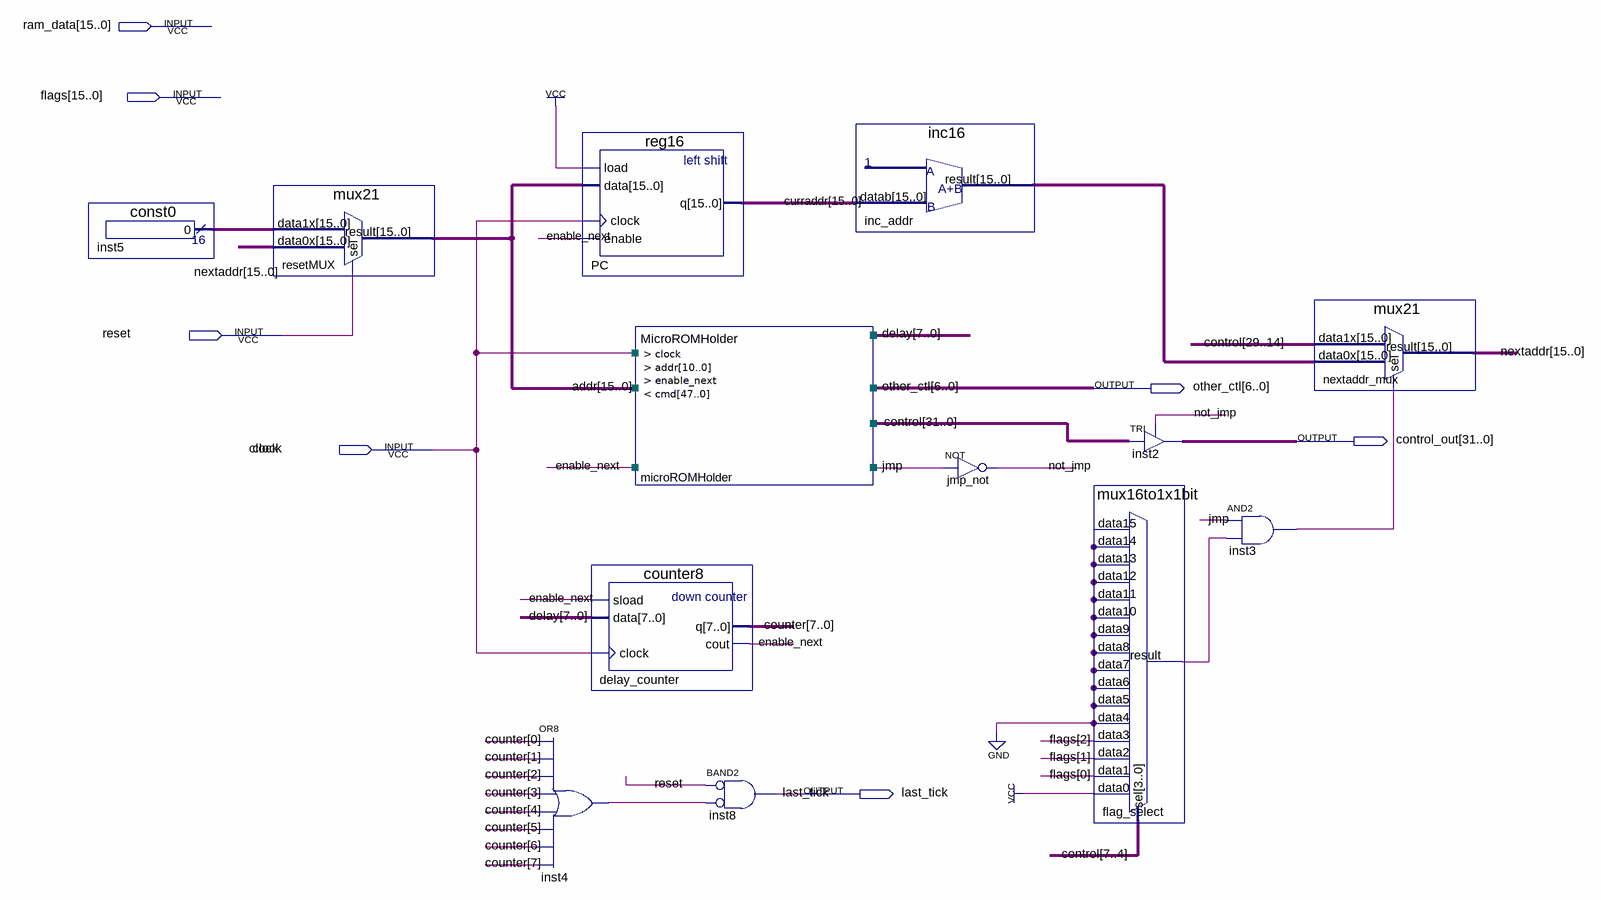
[diagram p0: schematic sheet]
// Quartus schematic BMC.bdf as structural Verilog: 13 symbols, 7 pins
module BMC (
  input  [15:0] ram_data,
  input  [15:0] flags,
  input  reset,
  input  clock,
  output [6:0] other_ctl,
  output [31:0] control_out,
  output last_tick
);

  wire enable_next, flag_select_result, inst3_out, inst4_out, jmp, not_jmp;
  wire [7:0] counter, delay;
  wire [15:0] addr, curraddr, inc_addr_result, inst5_result, nextaddr;
  wire [31:0] control;

  const0 inst5 (.result(inst5_result));
  mux21 resetMUX (.data1x(inst5_result), .data0x(nextaddr), .sel(reset), .result(addr));
  or inst4 (inst4_out, counter[0], counter[1], counter[2], counter[3], counter[4], counter[5], counter[6], counter[7]);
  reg16 PC (.load(1'b1), .data(addr), .clock(clock), .enable(enable_next), .q(curraddr));
  MicroROMHolder microROMHolder (.clock(clock), .addr(addr[10:0]), .enable_next(enable_next));  // open: cmd
  counter8 delay_counter (.sload(enable_next), .data(delay), .clock(clock), .cout(enable_next), .q(counter));
  and inst8 (last_tick, ~reset, ~inst4_out);  // BAND2
  inc16 inc_addr (.datab(curraddr), .result(inc_addr_result));
  not jmp_not (not_jmp, jmp);
  TRI inst2[31:0] (.IN(control), .OE(not_jmp), .OUT(control_out));
  mux16to1x1bit flag_select (
    .data15(1'b0), .data14(1'b0), .data13(1'b0), .data12(1'b0), .data11(1'b0), .data10(1'b0), .data9(1'b0),
    .data8(1'b0), .data7(1'b0), .data6(1'b0), .data5(1'b0), .data4(1'b0), .data3(flags[2]), .data2(flags[1]),
    .data1(flags[0]), .data0(1'b1), .sel(control[7:4]), .result(flag_select_result));
  and inst3 (inst3_out, jmp, flag_select_result);
  mux21 nextaddr_mux (.data1x(control[29:14]), .data0x(inc_addr_result), .sel(inst3_out), .result(nextaddr));
endmodule
